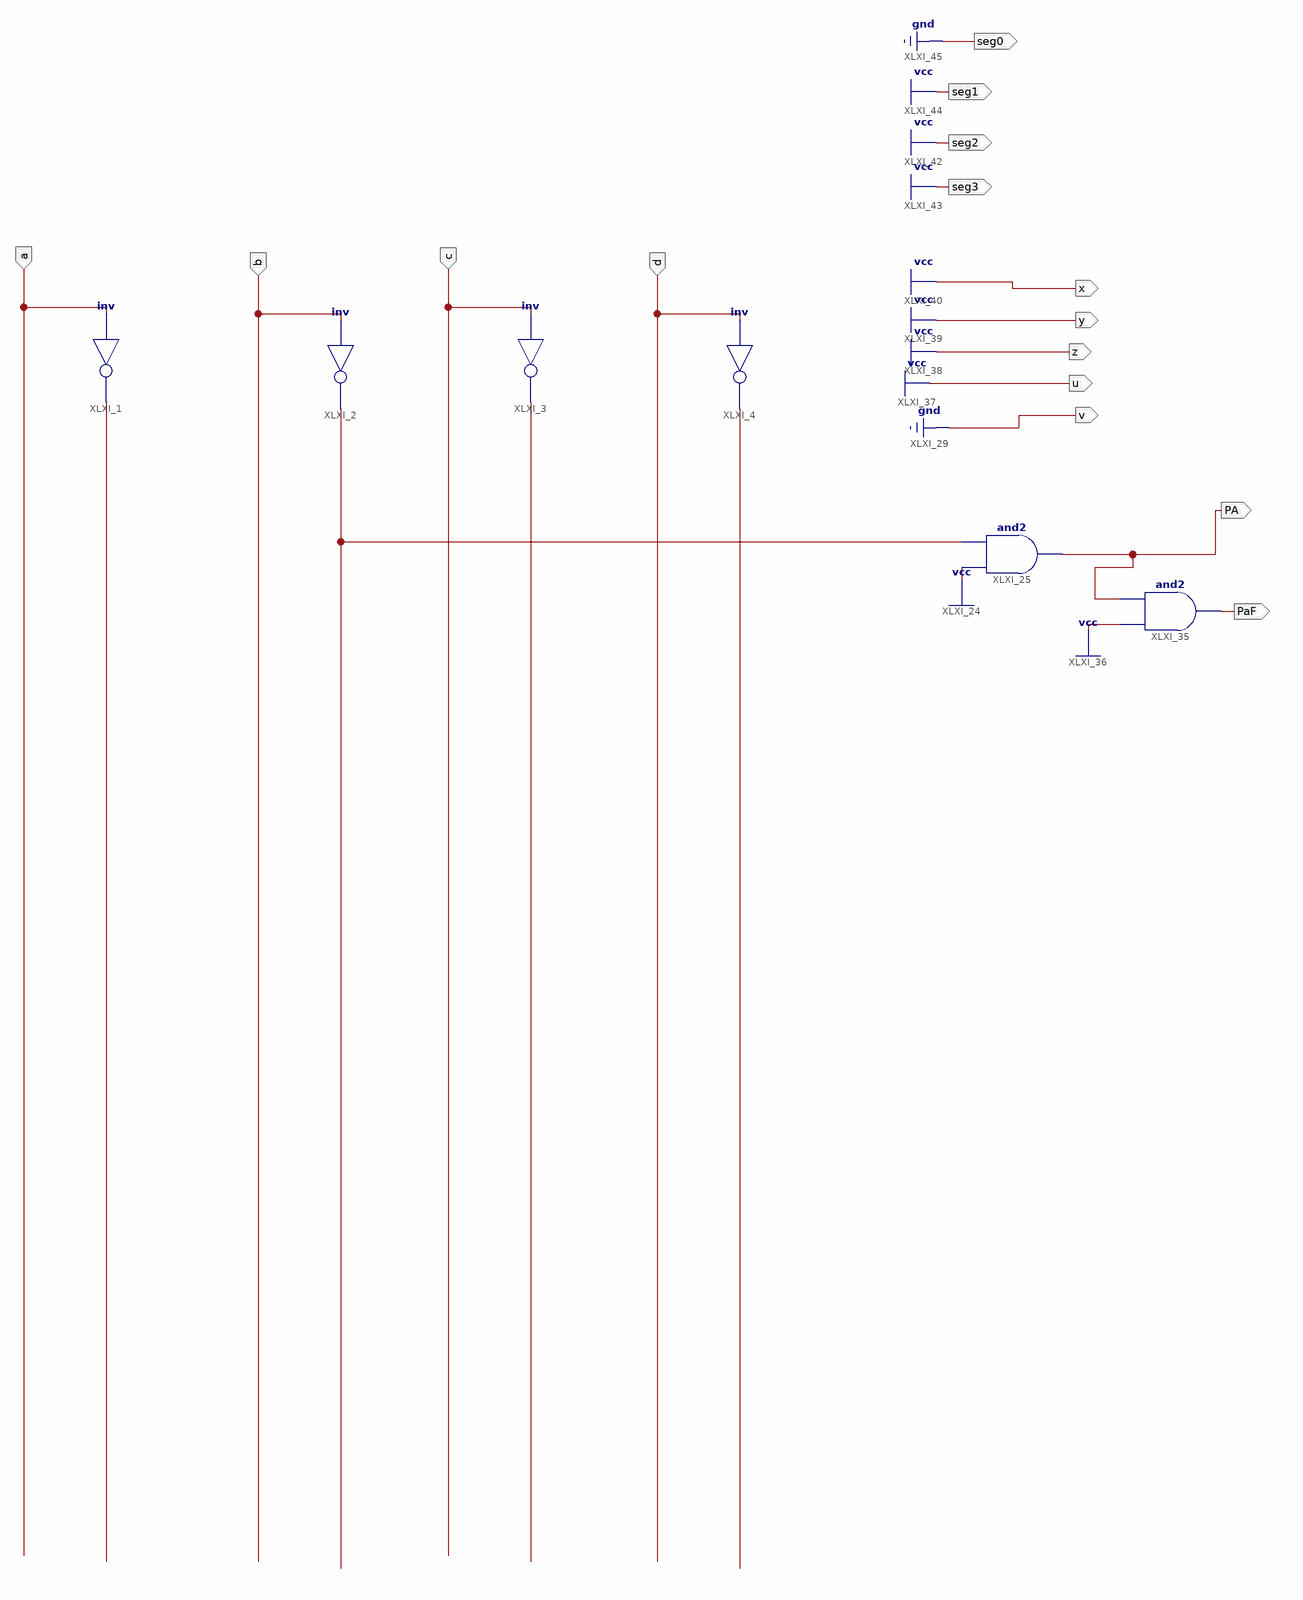
[diagram p0: schematic sheet 1]
// Xilinx ISE schematic katerm.sch (spartan6) as structural Verilog: 6 symbols, 15 ports
module katerm (
  input  a,
  input  b,
  input  c,
  input  d,
  output PA,
  output z,
  output u,
  output v,
  output y,
  output x,
  output PaF,
  output seg0,
  output seg1,
  output seg2,
  output seg3
);

  wire paid, XLXN_41, XLXN_42, XLXN_44;

  not XLXI_1 (XLXN_41, a);
  not XLXI_2 (paid, b);
  not XLXI_3 (XLXN_44, c);
  not XLXI_4 (XLXN_42, d);
  and XLXI_25 (PA, 1'b1, paid);
  and XLXI_35 (PaF, 1'b1, PA);

  assign seg0 = 1'b0;
  assign seg1 = 1'b1;
  assign seg2 = 1'b1;
  assign seg3 = 1'b1;
  assign u = 1'b1;
  assign v = 1'b0;
  assign x = 1'b1;
  assign y = 1'b1;
  assign z = 1'b1;
endmodule
